# Altium schematic sheet STLink_V3E_SWD.SchDoc: ST-LINK V3 SWD Module
size A3; Date: Not used; ApprovedBy: Not used; CheckedBy: Not used; Author: Not used; CompanyName: STMicroelectronics; DrawnBy: Not used; Engineer: Not used; Organization: Not used; Address1: Not used; Address2: Not used; Address3: Not used; Address4: Not used; DocumentNumber: Not used; Revision: Not used; SheetNumber: 21; SheetTotal: 22; CurrentTime: Not used; CurrentDate: Not used; Time: Not used; DocumentFullPathAndName: Not used; DocumentName: Not used; ModifiedDate: Not used; ImagePath: Not used; ProjectName: Not used; Application_BuildNumber: Not used
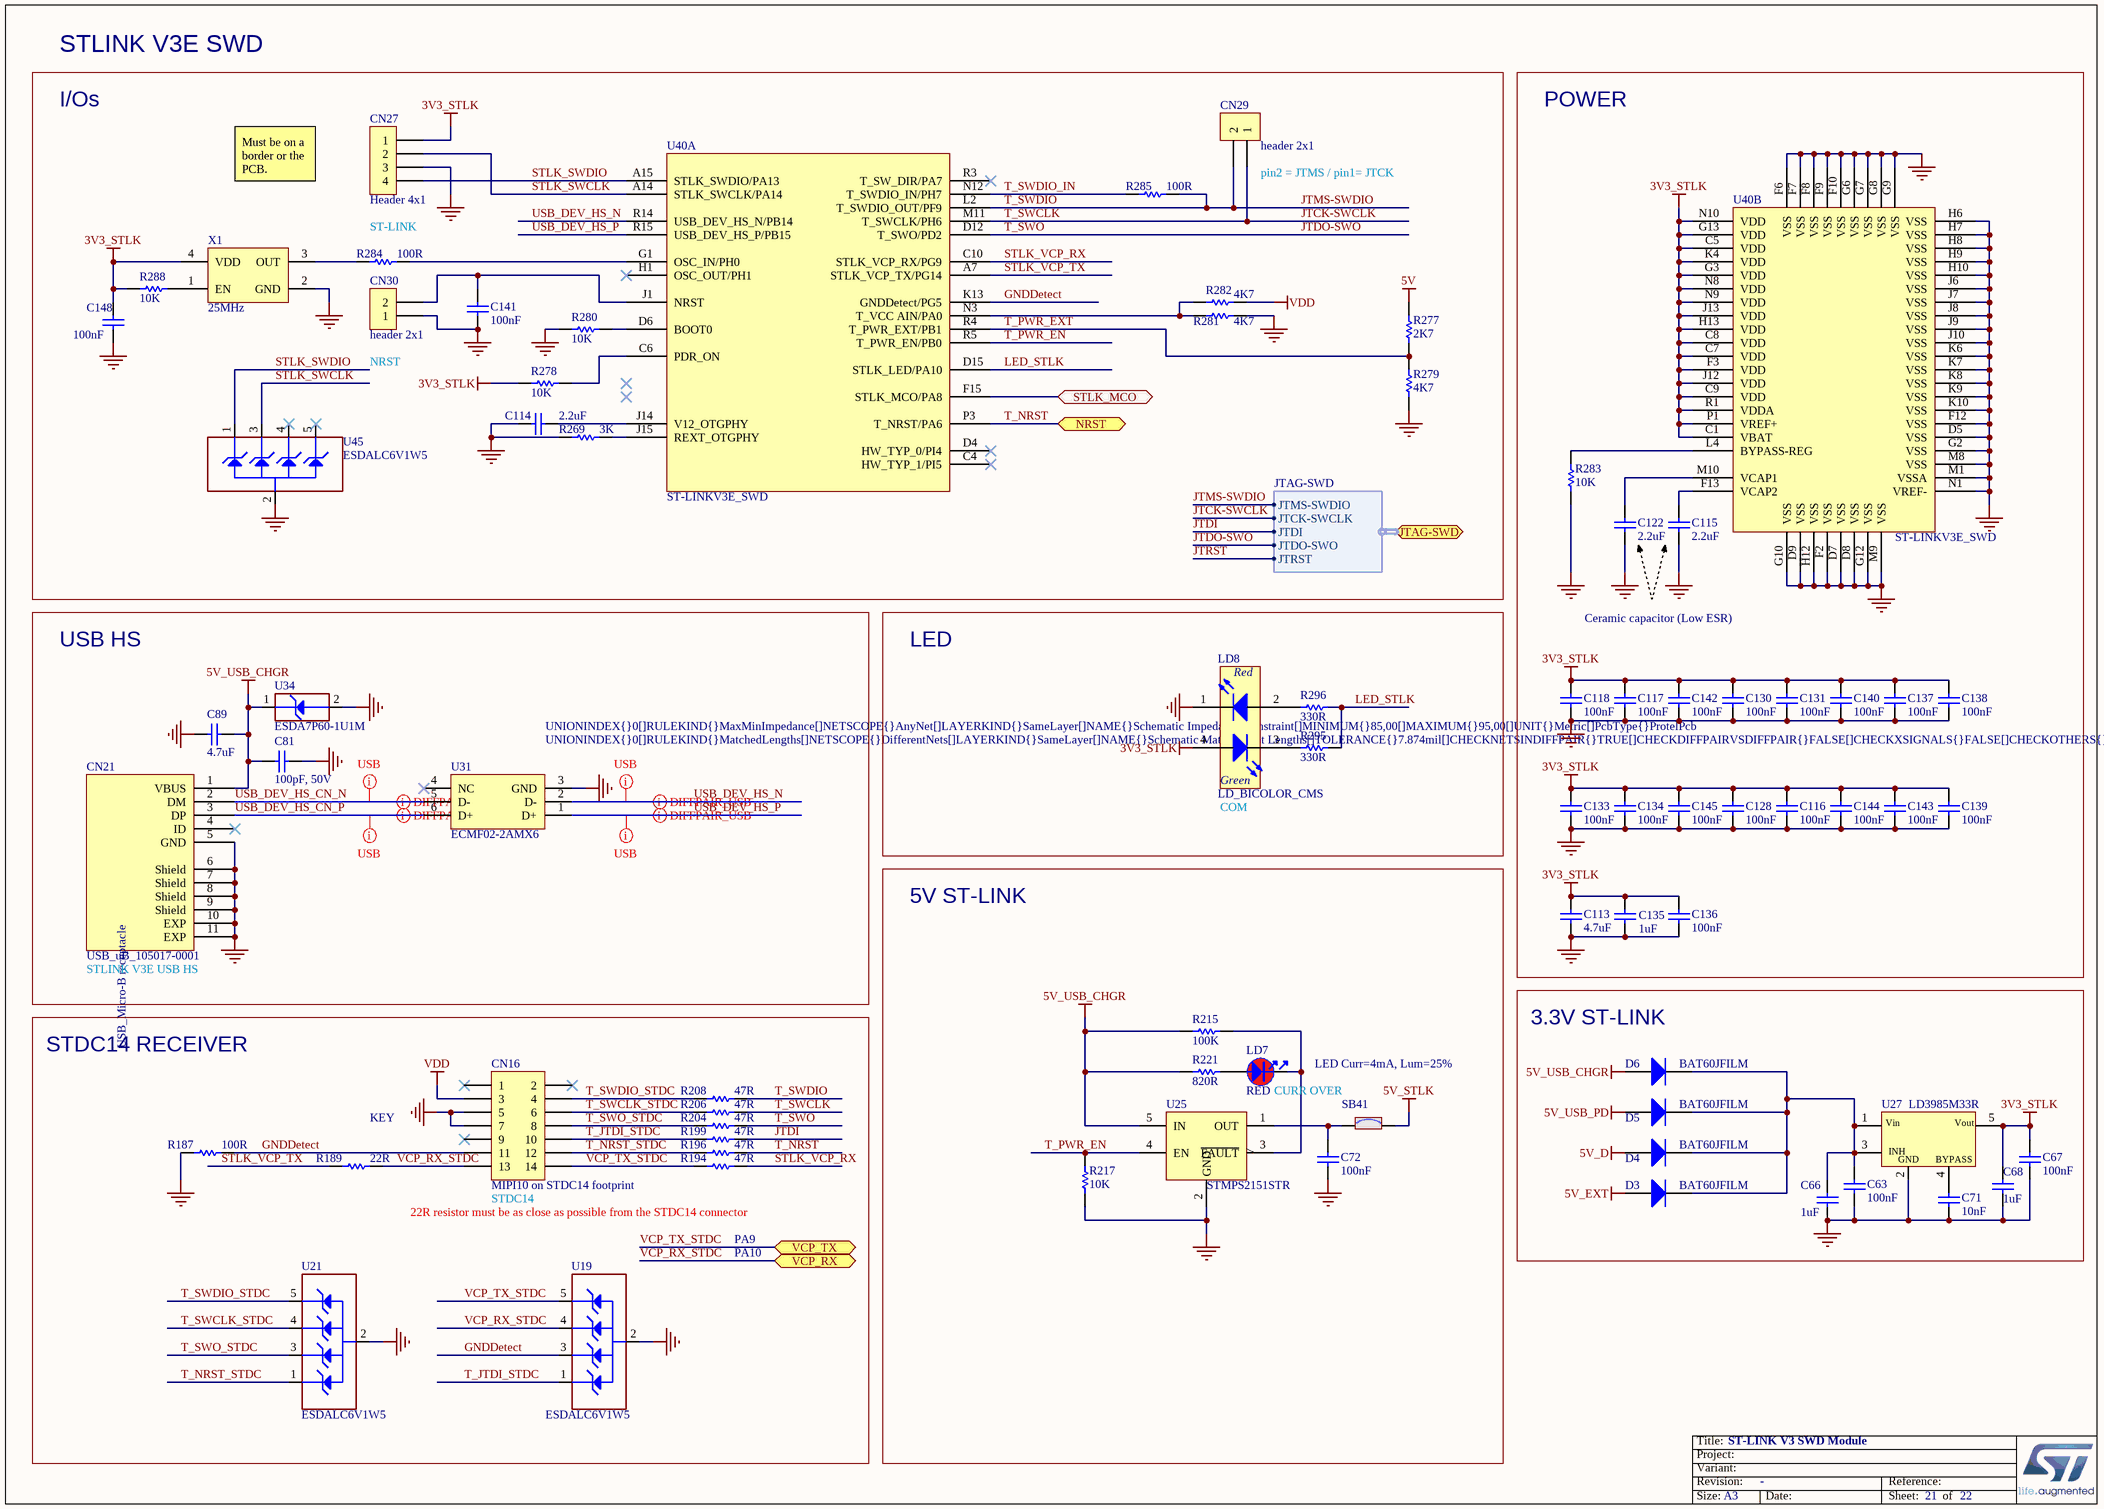
[diagram p0: STLink_V3E_SWD.SchDoc]

## Parts
C63  value 100nF  [C0402]  (hidden comment: Capacitor)
C66  value 1uF  [C0603]  (hidden comment: Capacitor)
C67  value 100nF  [C0603]  (hidden comment: Capacitor)
C68  value 1uF  [C0603]  (hidden comment: Capacitor)
C71  value 10nF  [C0402]  (hidden comment: Capacitor)
C72  value 100nF  [C0402]  (hidden comment: Capacitor)
C81  value 100pF, 50V  [C0603]  (hidden comment: Capacitor)
C89  value 4.7uF  [C0603]  (hidden comment: Capacitor)
C113  value 4.7uF  [C0603]  (hidden comment: Capacitor)
C114  value 2.2uF  [C0603]  (hidden comment: Capacitor)
C115  value 2.2uF  [C1206_H1P15]  (hidden comment: Capacitor)
C116  value 100nF  [C0402]  (hidden comment: Capacitor)
C117  value 100nF  [C0402]  (hidden comment: Capacitor)
C118  value 100nF  [C0402]  (hidden comment: Capacitor)
C122  value 2.2uF  [C1206_H1P15]  (hidden comment: Capacitor)
C128  value 100nF  [C0402]  (hidden comment: Capacitor)
C130  value 100nF  [C0402]  (hidden comment: Capacitor)
C131  value 100nF  [C0402]  (hidden comment: Capacitor)
C133  value 100nF  [C0402]  (hidden comment: Capacitor)
C134  value 100nF  [C0402]  (hidden comment: Capacitor)
C135  value 1uF  [C0603]  (hidden comment: Capacitor)
C136  value 100nF  [C0402]  (hidden comment: Capacitor)
C137  value 100nF  [C0402]  (hidden comment: Capacitor)
C138  value 100nF  [C0402]  (hidden comment: Capacitor)
C139  value 100nF  [C0402]  (hidden comment: Capacitor)
C140  value 100nF  [C0402]  (hidden comment: Capacitor)
C141  value 100nF  [C0402]  (hidden comment: Capacitor)
C142  value 100nF  [C0402]  (hidden comment: Capacitor)
C143  value 100nF  [C0402]  (hidden comment: Capacitor)
C144  value 100nF  [C0402]  (hidden comment: Capacitor)
C145  value 100nF  [C0402]  (hidden comment: Capacitor)
C148  value 100nF  [C0402]  (hidden comment: Capacitor)
CN16  value MIPI10 on STDC14 footprint  [CON_STDC14_Receiver_MEDIUM_WITH_MIPI10_3D]  (hidden comment: Header 7x2)
CN21  value USB_uB_105017-0001  [CON_USBMICROB_MOLEX_105017-0001_H2P90]  (hidden comment: USB_uB_105017.0001)
CN27  Header 4x1  [CON_SAMTEC_TSW-104-07-G-S]
CN29  Header 2x1  [CON_988-JIUBABA_PHFS25-11-02-G0B115-T-1]
CN30  Header 2x1  [CON_988-JIUBABA_PHFS25-11-02-G0B115-T-1]
D3  BAT60JFILM  [DIO_SOD323]
D4  BAT60JFILM  [DIO_SOD323]
D5  BAT60JFILM  [DIO_SOD323]
D6  BAT60JFILM  [DIO_SOD323]
LD7  value RED  [LED_0603_VISHAY_VLMS1300-GS08_RED_1A2K_H0P8]  (hidden comment: LED_red)
LD8  LD_BICOLOR_CMS  [LED_BI-GR_HSMF-A201-A00J1]
R187  value 100R  [R0402]  (hidden comment: Resistor)
R189  value 22R  [R0402]  (hidden comment: Resistor)
R194  value 47R  [R0402]  (hidden comment: Resistor)
R196  value 47R  [R0402]  (hidden comment: Resistor)
R199  value 47R  [R0402]  (hidden comment: Resistor)
R204  value 47R  [R0402]  (hidden comment: Resistor)
R206  value 47R  [R0402]  (hidden comment: Resistor)
R208  value 47R  [R0402]  (hidden comment: Resistor)
R215  value 100K  [R0603]  (hidden comment: Resistor)
R217  value 10K  [R0402]  (hidden comment: Resistor)
R221  value 820R  [R0402]  (hidden comment: Resistor)
R269  value 3K  [R0402]  (hidden comment: Resistor)
R277  value 2K7  [R0402]  (hidden comment: Resistor)
R278  value 10K  [R0402]  (hidden comment: Resistor)
R279  value 4K7  [R0402]  (hidden comment: Resistor)
R280  value 10K  [R0402]  (hidden comment: Resistor)
R281  value 4K7  [R0402]  (hidden comment: Resistor)
R282  value 4K7  [R0402]  (hidden comment: Resistor)
R283  value 10K  [R0402]  (hidden comment: Resistor)
R284  value 100R  [R0402]  (hidden comment: Resistor)
R285  value 100R  [R0402]  (hidden comment: Resistor)
R288  value 10K  [R0402]  (hidden comment: Resistor)
R295  value 330R  [R0603]  (hidden comment: Resistor)
R296  value 330R  [R0603]  (hidden comment: Resistor)
SB41  SB_ON  [SOLDER-BRIDGE_R0603-0R]  (value not drawn)
U19  ESDALC6V1W5  [ESD_SOT323-5L]
U21  ESDALC6V1W5  [ESD_SOT323-5L]
U25  STMPS2151STR  [MOS_SOT23-5L]
U27  LD3985M33R  [REG_SOT23-5L]
U31  ECMF02-2AMX6  [ESD_QFN-6L_1P7X1P5_P050]
U34  value ESDA7P60-1U1M  [ESD_QFN2_1P6X1_P125]  (hidden comment: ESD-TRANSIL)
U40  ST-LINKV3E_SWD  [ICC_UFBGA201_176+25_10X10_P065]  (parts A,B of 2)
U45  ESDALC6V1W5  [ESD_SOT323-5L]
X1  value 25MHz  [OSC_NDK_NZ2520SB_4P]  (hidden comment: OSCILLATOR_4_PINS)

## Blocks framed on the sheet
STLINK V3E SWD: C114 C141 C148 CN27 CN29 CN30 R269 R277-R282 R284 R285 R288 U40 U45 X1
POWER: C113 C115-C118 C122 C128 C130 C131 C133-C140 C142-C145 R283 U40
USB HS: C81 C89 CN21 U31 U34
LED: LD8 R295 R296
5V ST-LINK: C72 LD7 R215 R217 R221 SB41 U25
3.3V ST-LINK: C63 C66-C68 C71 D3-D6 U27
STDC14 RECEIVER: CN16 R187 R189 R194 R196 R199 R204 R206 R208 U19 U21

## Ports
JTAG-SWD (harness JTAG-SWD), NRST, STLK_MCO, VCP_RX, VCP_TX

## Harnesses
JTAG-SWD: JTMS-SWDIO, JTCK-SWCLK, JTDI, JTDO-SWO, JTRST

## Nets
3V3_STLK: C67.2 C68.2 C113.2 C116.2 C117.2 C118.2 C128.2 C130.2 C131.2 C133.2 C134.2 C135.2 C136.2 C137.2 C138.2 C139.2 C140.2 C142.2 C143.2 C144.2 C145.2 C148.2 CN27.1 LD8.4(YellowGreen_anode) R278.1 R288.1 U27.5(Vout) U40.C1(VBAT) U40.C5(VDD) U40.C7(VDD) U40.C8(VDD) U40.C9(VDD) U40.F3(VDD) U40.G3(VDD) U40.G13(VDD) U40.H13(VDD) U40.J12(VDD) U40.J13(VDD) U40.K4(VDD) U40.N8(VDD) U40.N9(VDD) U40.N10(VDD) U40.P1(VREF+) U40.R1(VDDA) X1.4(VDD)
5V: R277.2
5V_D: D4.1(A)
5V_EXT: D3.1(A)
5V_STLK: SB41.2
5V_USB_CHGR: C81.1 C89.2 CN21.1(VBUS) D6.1(A) R215.1 R221.1 U25.5(IN) U34.1(IO1)
5V_USB_PD: D5.1(A)
GND: C63.1 C66.2 C67.1 C68.1 C71.1 C72.1 C81.2 C89.1 C113.1 C114.1 C115.1 C116.1 C117.1 C118.1 C122.1 C128.1 C130.1 C131.1 C133.1 C134.1 C135.1 C136.1 C137.1 C138.1 C139.1 C140.1 C141.1 C142.1 C143.1 C144.1 C145.1 C148.1 CN16.5 CN16.7 CN21.5(GND) CN21.6(Shield) CN21.7(Shield) CN21.8(Shield) CN21.9(Shield) CN21.10(EXP) CN21.11(EXP) CN27.3 CN30.1 LD8.1(RED_cathode) R187.1 R217.1 R269.1 R279.1 R280.1 R281.2 R283.1 U19.2(GND) U21.2(GND) U25.2(GND) U27.2(GND) U31.3(GND) U34.2(GND) U40.D5(VSS) U40.D7(VSS) U40.D8(VSS) U40.D9(VSS) U40.F2(VSS) U40.F6(VSS) U40.F7(VSS) U40.F8(VSS) U40.F9(VSS) U40.F10(VSS) U40.F12(VSS) U40.G2(VSS) U40.G6(VSS) U40.G7(VSS) U40.G8(VSS) U40.G9(VSS) U40.G10(VSS) U40.G12(VSS) U40.H6(VSS) U40.H7(VSS) U40.H8(VSS) U40.H9(VSS) U40.H10(VSS) U40.H12(VSS) U40.J6(VSS) U40.J7(VSS) U40.J8(VSS) U40.J9(VSS) U40.J10(VSS) U40.K6(VSS) U40.K7(VSS) U40.K8(VSS) U40.K9(VSS) U40.K10(VSS) U40.M1(VSSA) U40.M8(VSS) U40.M9(VSS) U40.N1(VREF-) U45.2(GND) X1.2(GND)
VDD: CN16.3 R282.2
GNDDetect: CN16.11 R187.2 U19.3(IO2) U40.K13(GNDDetect/PG5)
JTCK-SWCLK: CN29.1 R206.2 U40.M11(T_SWCLK/PH6) ; port JTAG-SWD.JTCK-SWCLK  [also labelled T_SWCLK]
JTDI: R199.2 ; port JTAG-SWD.JTDI
JTDO-SWO: R204.2 U40.D12(T_SWO/PD2) ; port JTAG-SWD.JTDO-SWO  [also labelled T_SWO]
JTMS-SWDIO: CN29.2 R208.2 R285.2 U40.L2(T_SWDIO_OUT/PF9) ; port JTAG-SWD.JTMS-SWDIO  [also labelled T_SWDIO]
JTRST: port JTAG-SWD.JTRST
LED_STLK: R295.2 R296.2 U40.D15(STLK_LED/PA10)
STLK_MCO: U40.F15(STLK_MCO/PA8) ; port STLK_MCO
STLK_SWCLK: CN27.2 U40.A14(STLK_SWCLK/PA14) U45.3(IO2)
STLK_SWDIO: CN27.4 U40.A15(STLK_SWDIO/PA13) U45.1(IO1)
STLK_VCP_RX: R194.2 U40.C10(STLK_VCP_RX/PG9)
STLK_VCP_TX: R189.1 U40.A7(STLK_VCP_TX/PG14)
T_JTDI_STDC: CN16.10 R199.1 U19.1(IO1)
T_NRST: R196.2 U40.P3(T_NRST/PA6) ; port NRST
T_NRST_STDC: CN16.12 R196.1 U21.1(IO1)
T_PWR_EN: R217.2 U25.4(EN) U40.R5(T_PWR_EN/PB0)
T_PWR_EXT: R277.1 R279.2 U40.R4(T_PWR_EXT/PB1)
T_SWCLK_STDC: CN16.6 R206.1 U21.4(IO3)
T_SWDIO_IN: R285.1 U40.N12(T_SWDIO_IN/PH7)
T_SWDIO_STDC: CN16.4 R208.1 U21.5(IO4)
T_SWO_STDC: CN16.8 R204.1 U21.3(IO2)
USB_DEV_HS_CN_N: CN21.2(DM) U31.5(D-)
USB_DEV_HS_CN_P: CN21.3(DP) U31.6(D+)
USB_DEV_HS_N: U31.2(D-) U40.R14(USB_DEV_HS_N/PB14)
USB_DEV_HS_P: U31.1(D+) U40.R15(USB_DEV_HS_P/PB15)
VCP_RX_STDC: CN16.13 R189.2 U19.4(IO3) ; port VCP_RX
VCP_TX_STDC: CN16.14 R194.1 U19.5(IO4) ; port VCP_TX
NetC63_2: C63.2 C66.1 D3.2(K) D4.2(K) D5.2(K) D6.2(K) U27.1(Vin) U27.3(CE)
NetC71_2: C71.2 U27.4(BYPASS)
NetC72_2: C72.2 SB41.1 U25.1(OUT)
NetC114_2: C114.2 U40.J14(V12_OTGPHY)
NetC115_2: C115.2 U40.F13(VCAP2)
NetC122_2: C122.2 U40.M10(VCAP1)
NetC141_2: C141.2 CN30.2 U40.J1(NRST)
NetLD7_1: LD7.1 R221.2
NetLD7_2: LD7.2 R215.2 U25.3(~{FAULT})
NetLD8_2: LD8.2(Red_anode) R296.1
NetLD8_3: LD8.3(YellowGreen_cathode) R295.1
NetR269_2: R269.2 U40.J15(REXT_OTGPHY)
NetR278_2: R278.2 U40.C6(PDR_ON)
NetR280_2: R280.2 U40.D6(BOOT0)
NetR281_1: R281.1 R282.1 U40.N3(T_VCC_AIN/PA0)
NetR283_2: R283.2 U40.L4(BYPASS-REG)
NetR284_1: R284.1 X1.3(OUT)
NetR284_2: R284.2 U40.G1(OSC_IN/PH0)
NetR288_2: R288.2 X1.1(EN)

Not connected (* = marked no-connect by the designer): CN16 1* 2* 9*; CN21 4(ID)*; U31 4(NC)*; U40 C4(HW_TYP_1/PI5)* D4(HW_TYP_0/PI4)* H1(OSC_OUT/PH1)* R3(T_SW_DIR/PA7)*; U45 4(IO3)* 5(IO4)*

## Layout directives
differential pair; rule Impedance Constraint [Min = 85.00    Max = 95.00    ]: USB_DEV_HS_CN_N, USB_DEV_HS_CN_P, USB_DEV_HS_N, USB_DEV_HS_P
rule Undefined; rule Matched Net Lengths [Tolerance = 0.2mm]; rule Impedance Constraint [Min = 85.00    Max = 95.00    ]: USB_DEV_HS_CN_N, USB_DEV_HS_CN_P, USB_DEV_HS_N, USB_DEV_HS_P

## Notes on the sheet
- I/Os
- Must be on a border or the PCB.
- (near CN29) pin2 = JTMS / pin1= JTCK
- ST-LINK
- (near CN30) NRST
- Ceramic capacitor (Low ESR)
- COM
- (near CN21) STLINK V3E USB HS
- (near R189) KEY
- (near LD7) CURR OVER
- LED Curr=4mA, Lum=25%
- 22R resistor must be as close as possible from the STDC14 connector
- (near CN16) STDC14
- PA9
- PA10
- Title:
- Project:
- Size:
- Revision:
- Variant:
- A3
- -
- Date:
- Reference:
- Sheet:
- of
- (in symbol MCD-00028) USB_Micro-B receptacle
- (in symbol MCD-00051) Red; Green
- (in symbol MCD-00086) INH

## Library data of the parts
C63 C72 C116-C118 C128 C130 C131 C133 C134 C136-C145 C148 = MCD-00006: Capacitor, MLCC, 100nF, 16V, X7R, 10%, 0402, T=0.5mm; Manufacturer_Part_Number: CC0402KRX7R7BB104; Manufacturer: YAGEO; Alternate_Manufacturer_Part_Number: GCM155R71C104KA55D; Alternate_Manufacturer: MURATA; Provided_By: SUBCO; Initial_Board_Reference: MB1274; Path: ws/MCD_ApplicationBoards/Lists/MCDPARTSdatabase; Item Type: Item; Internal_Part_Number: MCD-00006; Status: Released; Package: C0402; ComponentLink1Description: Datasheet; Part_Type: Capacitor; ComponentLink1URL: http://tunmcdsvn.tun.st.com/Component_Datasheet_Library/Trunk/Capacitors/Yageo_Multilayer_Capacitor_X7R_series_100pF_to_22uF
C66 C68 C135 = MCD-00010: Capacitor, MLCC, 1uF, 16V, X5R, 10%, 0603, T=0,8mm; Manufacturer_Part_Number: CC0603KRX5R7BB105; Manufacturer: YAGEO; Provided_By: SUBCO; Initial_Board_Reference: MB1274; Path: ws/MCD_ApplicationBoards/Lists/MCDPARTSdatabase; Item Type: Item; Internal_Part_Number: MCD-00010; Status: Released; Part_Type: Capacitor; Package: C0603; ComponentLink1Description: Datasheet; ComponentLink1URL: http://tunmcdsvn.tun.st.com/Component_Datasheet_Library/Trunk/Capacitors/Yageo_Multilayer_capacitor_X5R_series_100pF_to_100uF
C67 = MCD-00211: Capacitor, MLCC, 100nF, 16V, X7R, 10%, 0603, T=0,8mm; Manufacturer_Part_Number: CC0603KRX7R7BB104; Manufacturer: YAGEO; Provided_By: SUBCO; Initial_Board_Reference: MB1319; Path: ws/MCD_ApplicationBoards/Lists/MCDPARTSdatabase; Item Type: Item; Internal_Part_Number: MCD-00211; Status: Released; Package: C0603; ComponentLink1Description: Datasheet; Part_Type: Capacitor; ComponentLink1URL: http://tunmcdsvn.tun.st.com/Component_Datasheet_Library/Trunk/Capacitors/Yageo_Multilayer_Capacitor_X7R_series_100pF_to_22uF
C71 = MCD-00011: Capacitor, MLCC, 10nF, 16V, X7R, 10%, 0402, T=0.5mm; Manufacturer_Part_Number: CC0402KRX7R7BB103; Manufacturer: YAGEO; Provided_By: SUBCO; Initial_Board_Reference: MB1274; Path: ws/MCD_ApplicationBoards/Lists/MCDPARTSdatabase; Item Type: Item; Internal_Part_Number: MCD-00011; Status: Released; Part_Type: Capacitor; Package: C0402; ComponentLink1Description: Datasheet; ComponentLink1URL: http://tunmcdsvn.tun.st.com/Component_Datasheet_Library/Trunk/Capacitors/Yageo_Multilayer_Capacitor_X7R_series_100pF_to_22uF
C81 = MCD-01101: Capacitor,100pF,50V,X7R,10%,0603; Manufacturer_Part_Number: 06035C101JAT4A; Manufacturer: AVX; Provided_By: SUBCO; Initial_Board_Reference: MB1381; Path: ws/MCD_ApplicationBoards/Lists/MCDPARTSdatabase; Item Type: Item; Internal_Part_Number: MCD-01101; Status: Footprint available; Part_Type: Capacitor; Package: C0603; ComponentLink1Description: Datasheet; ComponentLink1URL: http://tunmcdsvn.tun.st.com/Component_Datasheet_Library/Trunk/Capacitors/AVX_Capacitor_X7R-series/AVX_X7R-series.pdf
C89 C113 = MCD-00009: Capacitor, MLCC, 4.7uF, 16V, X5R, 10%, 0603, T=0.8mm; Manufacturer_Part_Number: CC0603KRX5R7BB475; Manufacturer: YAGEO; Provided_By: SUBCO; Initial_Board_Reference: MB1274; Path: ws/MCD_ApplicationBoards/Lists/MCDPARTSdatabase; Item Type: Item; Internal_Part_Number: MCD-00009; Status: Released; Part_Type: Capacitor; Package: C0603; ComponentLink1Description: Datasheet; ComponentLink1URL: http://tunmcdsvn.tun.st.com/Component_Datasheet_Library/Trunk/Capacitors/Yageo_Multilayer_capacitor_X5R_series_100pF_to_100uF
C114 = MCD-00012: Capacitor, MLCC, 2.2uF, 10V, X5R, 10%, 0603, T=0,8mm; Manufacturer_Part_Number: CC0603KRX5R6BB225; Manufacturer: YAGEO; Alternate_Manufacturer_Part_Number: C0603C225K8PACTU; Alternate_Manufacturer: KEMET; Provided_By: SUBCO; Initial_Board_Reference: MB1274; Path: ws/MCD_ApplicationBoards/Lists/MCDPARTSdatabase; Item Type: Item; Internal_Part_Number: MCD-00012; Status: Released; Package: C0603; ComponentLink1Description: Datasheet; Part_Type: Capacitor; ComponentLink1URL: http://tunmcdsvn.tun.st.com/Component_Datasheet_Library/Trunk/Capacitors/Yageo_Multilayer_capacitor_X5R_series_100pF_to_100uF
C115 C122 = MCD-00008: Capacitor, MLCC, 2.2uF, 16V, X7R, 10%, 1206, T=1,15mm; Manufacturer_Part_Number: CC1206KKX7R7BB225; Manufacturer: YAGEO; Alternate_Manufacturer_Part_Number: C1206C225K4RAC; Alternate_Manufacturer: KEMET; Provided_By: SUBCO; Initial_Board_Reference: MB1274; Path: ws/MCD_ApplicationBoards/Lists/MCDPARTSdatabase; Item Type: Item; Internal_Part_Number: MCD-00008; Status: Released; Part_Type: Capacitor; Package: C1206; ComponentLink1Description: Datasheet; ComponentLink1URL: http://tunmcdsvn.tun.st.com/Component_Datasheet_Library/Trunk/Capacitors/Yageo_Multilayer_Capacitor_X7R_series_100pF_to_22uF
CN16 = MCD-01226: Header 5x2, 1.27mm, Dual row, Straight, Surface mount, vertical male connector. 3.05mm lead. Mates with FFSD connector. Footprint compatible with FTSH-107-01-L-DV,-K,-A,-P,-ES (STDC14 MEDIUM); Manufacturer_Part_Number: FTSH-105-01-L-DV-K; Manufacturer: SAMTEC; Provided_By: SUBCO; Initial_Board_Reference: MCD16-052; Path: ws/MCD_ApplicationBoards/Lists/MCDPARTSdatabase; Item Type: Item; Internal_Part_Number: MCD-01226; Status: Released; Part_Type: Connector; ComponentLink1Description: Datasheet; ComponentLink1URL: http://tunmcdsvn.tun.st.com/Component_Datasheet_Library/Trunk/Connectors/Samtec_FTSH_smt_series
CN21 = MCD-00028: USB-MICRO-B, 0.65mm, RA, SMT, Bottom Mount,; Manufacturer_Part_Number: 1050170001; Manufacturer: MOLEX; Part_Type: Connector; Provided_By: SUBCO; Initial_Board_Reference: MB1274; Path: ws/MCD_ApplicationBoards/Lists/MCDPARTSdatabase; Item Type: Item; Internal_Part_Number: MCD-00028; Status: Released; ComponentLink1Description: Datasheet; ComponentLink1URL: http://tunmcdsvn.tun.st.com/Component_Datasheet_Library/Trunk/Connectors/Molex_Connector-USB-microB_105017-0001
CN27 = MCD-00029: Header, 4x1, 2,54mm, VR, TH, Height 5.84mm/2.54mm; Manufacturer_Part_Number: TSW-104-07-x-S; Manufacturer: SAMTEC; Part_Type: Connector; Provided_By: SUBCO; Initial_Board_Reference: MB1274; Path: ws/MCD_ApplicationBoards/Lists/MCDPARTSdatabase; Item Type: Item; Internal_Part_Number: MCD-00029; Value: Header 4x1; Status: Released; ComponentLink1Description: Datasheet; ComponentLink1URL: http://tunmcdsvn.tun.st.com/Component_Datasheet_Library/Trunk/Connectors/Samtec_TSW-HTSW-series
CN29 CN30 = MCD-00314: Header, 2x1, 2.54mm, VR, TH, Height 6mm/3mm; Part_Type: Connector; Manufacturer_Part_Number: PHFS25-11-02-G0B115-T-1; Manufacturer: JIUBABA; Provided_By: SUBCO; Initial_Board_Reference: MB1311; Path: ws/MCD_ApplicationBoards/Lists/MCDPARTSdatabase; Item Type: Item; Internal_Part_Number: MCD-00314; Value: header 2x1; Status: Released; ComponentLink1Description: Datasheet; ComponentLink1URL: http://tunmcdsvn.tun.st.com/Component_Datasheet_Library/Trunk/Connectors/Jiubaba_PHFS25_11XXXXXXXXXX
D3-D6 = MCD-00034: Manufacturer: STMICROELECTRONICS; Part_Type: Diode; BMS_Part_Number: 9151097; Provided_By: SUBCO with ST control; Initial_Board_Reference: MB1274; Path: ws/MCD_ApplicationBoards/Lists/MCDPARTSdatabase; Item Type: Item; Internal_Part_Number: MCD-00034; Value: BAT60JFILM; Status: Released; Manufacturer_Part_Number: BAT60JFILM; ComponentLink1Description: Datasheet; ComponentLink1URL: http://tunmcdsvn.tun.st.com/Component_Datasheet_Library/Trunk/Diodes/STM_Diode_BAT60JFILM-SOD323
LD7 = MCD-00587: LED Red, 0603 SMD, 2V Forward Voltage; Part_Type: Display; Manufacturer_Part_Number: VLMS1300-GS08; Manufacturer: VISHAY; Alternate_Manufacturer_Part_Number: LS Q976-NR-1; Alternate_Manufacturer: OSRAM OPTO SEMICONDUCTORS; Provided_By: SUBCO; Initial_Board_Reference: MB1331; Path: ws/MCD_ApplicationBoards/Lists/MCDPARTSdatabase; Item Type: Item; Internal_Part_Number: MCD-00587; Status: Released; ComponentLink1Description: Datasheet; ComponentLink1URL: http://tunmcdsvn.tun.st.com/Component_Datasheet_Library/Trunk/Display/VISHAY_LED_RED_VLMS1300-GS08; Order_Code_Digikey: VLMS1300-GS08CT-ND; Order_Code_Farnell: 2078728; Package: LED 0603
LD8 = MCD-00051: LED Bicolor; Part_Type: Display; Manufacturer_Part_Number: HSMF-A201-A00J1; Manufacturer: AVAGO TECHNOLOGIES; Alternate_Manufacturer_Part_Number: LE-RGW35280; Alternate_Manufacturer: EVERLUCK; Provided_By: SUBCO; Initial_Board_Reference: MB1274; Path: ws/MCD_ApplicationBoards/Lists/MCDPARTSdatabase; Item Type: Item; Internal_Part_Number: MCD-00051; Value: LD_BICOLOR_CMS; Status: Released; ComponentLink1Description: Datasheet; ComponentLink1URL: http://tunmcdsvn.tun.st.com/Component_Datasheet_Library/Trunk/Display/Avago_LED-SMC_HSMx-A2xx-02Feb2012
R187 R284 R285 = MCD-00119: Resistor,100R,0402,1%,1/16W; Manufacturer_Part_Number: RC0402FR-07100RL; Manufacturer: YAGEO; Provided_By: SUBCO; Initial_Board_Reference: MB1262; Path: ws/MCD_ApplicationBoards/Lists/MCDPARTSdatabase; Item Type: Item; Internal_Part_Number: MCD-00119; Status: Released; Part_Type: Resistor; ComponentLink1Description: Datasheet; Package: R0402; ComponentLink1URL: http://tunmcdsvn.tun.st.com/Component_Datasheet_Library/Trunk/Resistors/Yageo_Resistor_RC0402-series
R189 = MCD-00189: Resistor,22R,0402,1%,1/16W; Manufacturer_Part_Number: RC0402FR-0722RL; Manufacturer: YAGEO; Provided_By: SUBCO; Initial_Board_Reference: MBxxxx; Path: ws/MCD_ApplicationBoards/Lists/MCDPARTSdatabase; Item Type: Item; Internal_Part_Number: MCD-00189; Status: Released; Part_Type: Resistor; Package: R0402; ComponentLink1Description: Datasheet; ComponentLink1URL: http://tunmcdsvn.tun.st.com/Component_Datasheet_Library/Trunk/Resistors/Yageo_Resistor_RC0402-series
R194 R196 R199 R204 R206 R208 = MCD-00481: Resistor,47R,0402,1%,1/16W; Internal_Part_Number: MCD-00481
R215 = MCD-00223: Resistor,100K,0603,1%,1/10W; Manufacturer_Part_Number: RC0603FR-07100KL; Manufacturer: YAGEO; Provided_By: SUBCO; Initial_Board_Reference: MB1319; Path: ws/MCD_ApplicationBoards/Lists/MCDPARTSdatabase; Item Type: Item; Internal_Part_Number: MCD-00223; Status: Released; Part_Type: Resistor; Package: R0603; ComponentLink1Description: Datasheet; ComponentLink1URL: http://tunmcdsvn.tun.st.com/Component_Datasheet_Library/Trunk/Resistors/Yageo_Resistor_RC0603-series
R217 R278 R280 R283 R288 = MCD-00053: Resistor,10K,0402,1%,1/16W; Manufacturer_Part_Number: RC0402FR-0710KL; Manufacturer: YAGEO; Provided_By: SUBCO; Initial_Board_Reference: MB1274; Path: ws/MCD_ApplicationBoards/Lists/MCDPARTSdatabase; Item Type: Item; Internal_Part_Number: MCD-00053; Status: Released; ComponentLink1Description: Datasheet; Part_Type: Resistor; Package: R0402; ComponentLink1URL: http://tunmcdsvn.tun.st.com/Component_Datasheet_Library/Trunk/Resistors/Yageo_Resistor_RC0402-series
R221 = MCD-00527: Resistor,820R,0402,1%,1/16W; Manufacturer_Part_Number: RC0402FR-07820RL; Manufacturer: YAGEO; Provided_By: SUBCO; Initial_Board_Reference: MBxxxx; Path: ws/MCD_ApplicationBoards/Lists/MCDPARTSdatabase; Item Type: Item; Internal_Part_Number: MCD-00527; Status: Released; Part_Type: Resistor; Package: R0402; ComponentLink1Description: Datasheet; ComponentLink1URL: http://tunmcdsvn.tun.st.com/Component_Datasheet_Library/Trunk/Resistors/Yageo_Resistor_RC0402-series
R269 = MCD-00185: Resistor,3K,0402,1%,1/16W; Manufacturer_Part_Number: RC0402FR-073KL; Manufacturer: YAGEO; Provided_By: SUBCO; Initial_Board_Reference: MBxxxx; Path: ws/MCD_ApplicationBoards/Lists/MCDPARTSdatabase; Item Type: Item; Internal_Part_Number: MCD-00185; Status: Released; ComponentLink1Description: Datasheet; Part_Type: Resistor; Package: R0402; ComponentLink1URL: http://tunmcdsvn.tun.st.com/Component_Datasheet_Library/Trunk/Resistors/Yageo_Resistor_RC0402-series
R277 = MCD-00055: Resistor,2K7,0402,1%,1/16W; Manufacturer_Part_Number: RC0402FR-072K7L; Manufacturer: YAGEO; Provided_By: SUBCO; Initial_Board_Reference: MB1274; Path: ws/MCD_ApplicationBoards/Lists/MCDPARTSdatabase; Item Type: Item; Internal_Part_Number: MCD-00055; Status: Released; ComponentLink1Description: Datasheet; Part_Type: Resistor; Package: R0402; ComponentLink1URL: http://tunmcdsvn.tun.st.com/Component_Datasheet_Library/Trunk/Resistors/Yageo_Resistor_RC0402-series
R279 R281 R282 = MCD-00065: Resistor,4K7,0402,1%,1/16W; Manufacturer_Part_Number: RC0402FR-074K7L; Manufacturer: YAGEO; Alternate_Manufacturer_Part_Number: RT0402FRE074K7L; Provided_By: SUBCO; Initial_Board_Reference: MB1274; Path: ws/MCD_ApplicationBoards/Lists/MCDPARTSdatabase; Item Type: Item; Internal_Part_Number: MCD-00065; Status: Released; ComponentLink1Description: Datasheet; Alternate_Manufacturer: YAGEO; Part_Type: Resistor; Package: R0402; ComponentLink1URL: http://tunmcdsvn.tun.st.com/Component_Datasheet_Library/Trunk/Resistors/Yageo_Resistor_RC0402-series
R295 R296 = MCD-00197: Resistor,330R,0603,1%,1/10W; Manufacturer_Part_Number: RC0603FR-07330RL; Manufacturer: YAGEO; BMS_Part_Number: 9129729; Provided_By: SUBCO; Initial_Board_Reference: MBxxxx; Path: ws/MCD_ApplicationBoards/Lists/MCDPARTSdatabase; Item Type: Item; Internal_Part_Number: MCD-00197; Status: Released; ComponentLink1Description: Datasheet; Part_Type: Resistor; Package: R0603; ComponentLink1URL: http://tunmcdsvn.tun.st.com/Component_Datasheet_Library/Trunk/Resistors/Yageo_Resistor_RC0603-series
SB41 = MCD-00071: Solder Bridge ON; Part_Type: Mechanical; Manufacturer_Part_Number: RC0603JR-070RL; Manufacturer: YAGEO; Provided_By: SUBCO; Initial_Board_Reference: MB1274; Path: ws/MCD_ApplicationBoards/Lists/MCDPARTSdatabase; Item Type: Item; Internal_Part_Number: MCD-00071; Status: Released; ComponentLink1Description: Datasheet; Package: SB0603; ComponentLink1URL: http://tunmcdsvn.tun.st.com/Component_Datasheet_Library/Trunk/Resistors/Yageo_Resistor_RC0603-series
U19 U21 = MCD-00136: Dual Transil array for ESD protection; Part_Type: Diode; Manufacturer: STMICROELECTRONICS; BMS_Part_Number: 9151112; Provided_By: SUBCO with ST control; Initial_Board_Reference: MB1262; Path: ws/MCD_ApplicationBoards/Lists/MCDPARTSdatabase; Item Type: Item; Internal_Part_Number: MCD-00136; Value: ESDALC6V1W5; Status: Released; Manufacturer_Part_Number: ESDALC6V1W5; ComponentLink1Description: Datasheet; ComponentLink1URL: http://tunmcdsvn.tun.st.com/Component_Datasheet_Library/Trunk/Diodes/STM_ESD_ESDALC6V1W5
U25 = MCD-00159: 500mA, Enhanced single channel power switches with active high enable pin; Part_Type: IC; Manufacturer: STMICROELECTRONICS; Alternate_Manufacturer_Part_Number: TPS2051C; Alternate_Manufacturer: TEXAS INSTRUMENTS; BMS_Part_Number: 9159009; Provided_By: SUBCO with ST control; Initial_Board_Reference: MB1264; Path: ws/MCD_ApplicationBoards/Lists/MCDPARTSdatabase; Item Type: Item; Internal_Part_Number: MCD-00159; Value: STMPS2151STR; Status: Released; Manufacturer_Part_Number: STMPS2151STR; ComponentLink1Description: Datasheet; ComponentLink1URL: http://tunmcdsvn.tun.st.com/Component_Datasheet_Library/Trunk/IC/STM_PWR-Switch_STMPS2151STR
U27 = MCD-00086: Ultra low drop-low noise BiCMOS voltage, regulators low ESR capacitors compatible; Manufacturer: STMICROELECTRONICS; Part_Type: IC; BMS_Part_Number: 9176161; Provided_By: SUBCO with ST control; Initial_Board_Reference: MB1274; Path: ws/MCD_ApplicationBoards/Lists/MCDPARTSdatabase; Item Type: Item; Internal_Part_Number: MCD-00086; Value: LD3985M33R; Status: Released; Manufacturer_Part_Number: LD3985M33R; ComponentLink1Description: Datasheet; ComponentLink1URL: http://tunmcdsvn.tun.st.com/Component_Datasheet_Library/Trunk/IC/STM_LDO_LD3985
U31 = MCD-00649: Common mode filter with ESD protection for USB 2.0 interface; Part_Type: Diode; Manufacturer: STMICROELECTRONICS; BMS_Part_Number: 9151138; Provided_By: SUBCO with ST control; Initial_Board_Reference: MB1248; Path: ws/MCD_ApplicationBoards/Lists/MCDPARTSdatabase; Item Type: Item; Internal_Part_Number: MCD-00649; Value: ECMF02-2AMX6; Status: Released; Manufacturer_Part_Number: ECMF02-2AMX6; ComponentLink1Description: Datasheet; ComponentLink1URL: http://tunmcdsvn.tun.st.com/Component_Datasheet_Library/Trunk/Diodes/STM_ESD_ECMF02-2AMX6
U34 = MCD-00251: High power transient voltage suppressor, 7V breakdown; Part_Type: Diode; Manufacturer: STMICROELECTRONICS; BMS_Part_Number: 9179042; Provided_By: SUBCO with ST control; Initial_Board_Reference: MB1311; Path: ws/MCD_ApplicationBoards/Lists/MCDPARTSdatabase; Item Type: Item; Internal_Part_Number: MCD-00251; Status: Released; Manufacturer_Part_Number: ESDA7P60-1U1M; ComponentLink1Description: Datasheet; ComponentLink1URL: http://tunmcdsvn.tun.st.com/Component_Datasheet_Library/Trunk/Diodes/STM_ESD_ESDA7P60-1U1M
U40 = MCD-00596: STM32F723IEK  (STM32F7) BGA176; Part_Type: IC; Manufacturer_Part_Number: STM32F723IEK6; Manufacturer: STMICROELECTRONICS; BMS_Part_Number: 9175300; Provided_By: SUBCO with ST control; Initial_Board_Reference: MB1331; Path: ws/MCD_ApplicationBoards/Lists/MCDPARTSdatabase; Item Type: Item; Internal_Part_Number: MCD-00596; Value: ST-LINKV3E_SWD; Status: Released; ComponentLink1Description: Datasheet; ComponentLink1URL: http://tunmcdsvn.tun.st.com/Component_Datasheet_Library/Trunk/IC/BGA176+25L_10x10x0.6_pitch0.65
U45 = MCD-00136: Dual Transil array for ESD protection; Manufacturer: STMICROELECTRONICS; Part_Type: Diode; BMS_Part_Number: 9151112; Provided_By: SUBCO with ST control; Initial_Board_Reference: MB1262; Path: ws/MCD_ApplicationBoards/Lists/MCDPARTSdatabase; Item Type: Item; Internal_Part_Number: MCD-00136; Value: ESDALC6V1W5; Manufacturer_Part_Number: ESDALC6V1W5; ComponentLink1Description: Datasheet; Status: Released; ComponentLink1URL: http://tunmcdsvn.tun.st.com/Component_Datasheet_Library/Trunk/Diodes/STM_ESD_ESDALC6V1W5
X1 = MCD-00597: Oscillator 25.00Mhz, -+50PPM, 3.3V, Temp -55 to +125°C; Manufacturer_Part_Number: NZ2520SB 25MHz END4869B; Manufacturer: NDK; Alternate_Manufacturer_Part_Number: KC2520B25.0000C10E00; Alternate_Manufacturer: AVX CORP/KYOCERA CORP; Part_Type: Crystal_Osc; BMS_Part_Number: 9157031; Provided_By: ST; Initial_Board_Reference: MB1331; Path: ws/MCD_ApplicationBoards/Lists/MCDPARTSdatabase; Item Type: Item; Internal_Part_Number: MCD-00597; Status: Released; ComponentLink1Description: Datasheet; ComponentLink1URL: http://tunmcdsvn.tun.st.com/Component_Datasheet_Library/Trunk/Crystal_Osc/NDK_OSCILLATOR_NZ2520SB; Order_Code_Digikey: 478-4780-1-ND